# Altium project oscilloscope_ext.PrjPcb
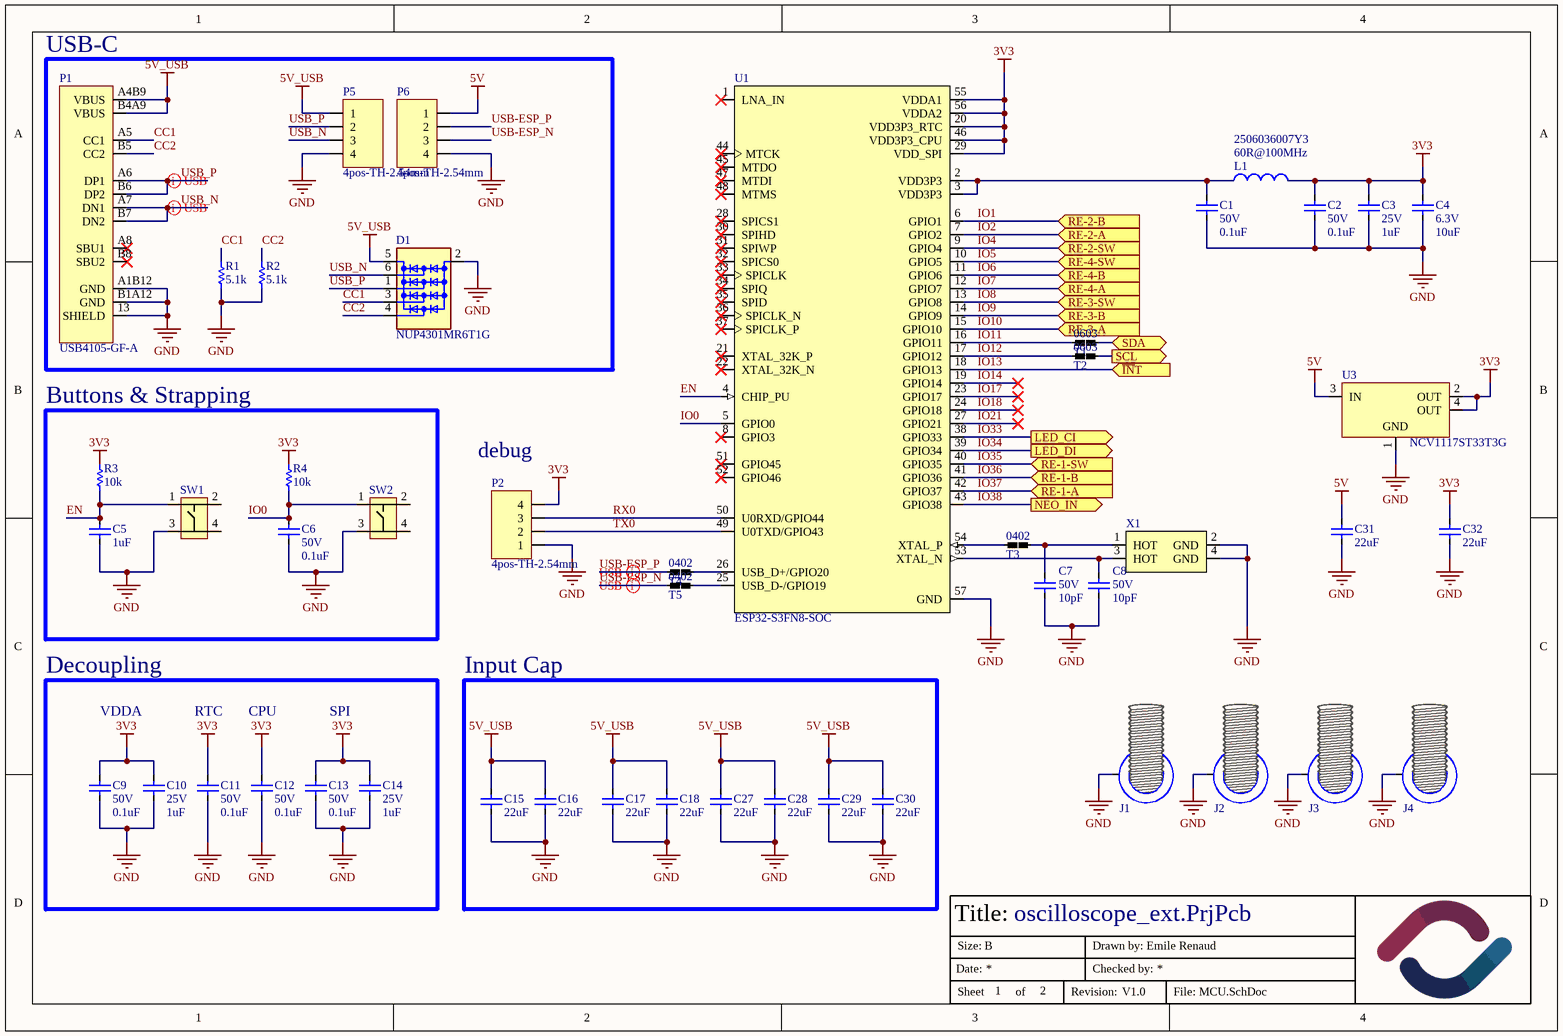
[diagram p0: MCU.SchDoc]
3 sheets, 116 parts. Net scope: flat (ports and power ports of the same name join across sheets).
Board files: oscilloscope_ext.PcbDoc, pcb_key.PcbDoc
Sheets:
  MCU.SchDoc
  RotaryEncoder.SchDoc
  CherryMX.SchDoc

## Sheet MCU.SchDoc
size A4; DrawnBy: Emile Renaud; Revision: V1.0; SheetNumber: 1; SheetTotal: 2

### Parts
C1  value 0.1uF  Volt: 50V  [CAPACITOR-0603]  (hidden comment: Capacitor-0603-0.1uF-50V-X7R)
C2  value 0.1uF  Volt: 50V  [CAPACITOR-0603]  (hidden comment: Capacitor-0603-0.1uF-50V-X7R)
C3  value 1uF  Volt: 25V  [CAPACITOR-0603]  (hidden comment: Capacitor-0603-1uF-25V-X5R)
C4  value 10uF  Volt: 6.3V  [CAPACITOR-0603]  (hidden comment: Capacitor-0603-10uF-6.3V-X5R)
C5  value 1uF  [CAPACITOR-0603]  (hidden comment: Capacitor-0603-1uF-25V-X5R)
C6  value 0.1uF  Volt: 50V  [CAPACITOR-0603]  (hidden comment: Capacitor-0603-0.1uF-50V-X7R)
C7  value 10pF  Volt: 50V  [CAPACITOR-0402]  (hidden comment: Capacitor-0402-10pF-50V-C0G)
C8  value 10pF  Volt: 50V  [CAPACITOR-0402]  (hidden comment: Capacitor-0402-10pF-50V-C0G)
C9  value 0.1uF  Volt: 50V  [CAPACITOR-0603]  (hidden comment: Capacitor-0603-0.1uF-50V-X7R)
C10  value 1uF  Volt: 25V  [CAPACITOR-0603]  (hidden comment: Capacitor-0603-1uF-25V-X5R)
C11  value 0.1uF  Volt: 50V  [CAPACITOR-0603]  (hidden comment: Capacitor-0603-0.1uF-50V-X7R)
C12  value 0.1uF  Volt: 50V  [CAPACITOR-0603]  (hidden comment: Capacitor-0603-0.1uF-50V-X7R)
C13  value 0.1uF  Volt: 50V  [CAPACITOR-0603]  (hidden comment: Capacitor-0603-0.1uF-50V-X7R)
C14  value 1uF  Volt: 25V  [CAPACITOR-0603]  (hidden comment: Capacitor-0603-1uF-25V-X5R)
C15  value 22uF  [CAPACITOR-0805]  (hidden comment: Capacitor-0805-22uF-16V-X5R)
C16  value 22uF  [CAPACITOR-0805]  (hidden comment: Capacitor-0805-22uF-16V-X5R)
C17  value 22uF  [CAPACITOR-0805]  (hidden comment: Capacitor-0805-22uF-16V-X5R)
C18  value 22uF  [CAPACITOR-0805]  (hidden comment: Capacitor-0805-22uF-16V-X5R)
C27  value 22uF  [CAPACITOR-0805]  (hidden comment: Capacitor-0805-22uF-16V-X5R)
C28  value 22uF  [CAPACITOR-0805]  (hidden comment: Capacitor-0805-22uF-16V-X5R)
C29  value 22uF  [CAPACITOR-0805]  (hidden comment: Capacitor-0805-22uF-16V-X5R)
C30  value 22uF  [CAPACITOR-0805]  (hidden comment: Capacitor-0805-22uF-16V-X5R)
C31  value 22uF  [CAPACITOR-0805]  (hidden comment: Capacitor-0805-22uF-16V-X5R)
C32  value 22uF  [CAPACITOR-0805]  (hidden comment: Capacitor-0805-22uF-16V-X5R)
D1  NUP4301MR6T1G  [SOT-23-6]
J1  hole  [HOLE-3.40MM-M3-8MMEYELET]  (value not drawn)  (no BOM)
J2  hole  [HOLE-3.40MM-M3-8MMEYELET]  (value not drawn)  (no BOM)
J3  hole  [HOLE-3.40MM-M3-8MMEYELET]  (value not drawn)  (no BOM)
J4  hole  [HOLE-3.40MM-M3-8MMEYELET]  (value not drawn)  (no BOM)
L1  2506036007Y3  value 60R@100MHz  [CAPACITOR-0603]
P1  USB4105-GF-A  [USB-C]
P2  4pos-TH-2.54mm  [HDR1X4]
P5  4pos-TH-2.54mm  [HDR1X4]
P6  4pos-TH-2.54mm  [HDR1X4]
R1  value 5.1k  [RESISTOR-0603]  (hidden comment: Resistor-0603-5.1k)
R2  value 5.1k  [RESISTOR-0603]  (hidden comment: Resistor-0603-5.1k)
R3  value 10k  [Resistor-0603]  (hidden comment: SMT resistor)
R4  value 10k  [Resistor-0603]  (hidden comment: SMT resistor)
SW1  PTS815 SJM 250 SMTR LFS  [SW4_PTS815 SJM 250 SMTR LFS_CNK]  (value not drawn)
SW2  PTS815 SJM 250 SMTR LFS  [SW4_PTS815 SJM 250 SMTR LFS_CNK]  (value not drawn)
T1  NetTie_0603  [NetTie-0603-short]  (value not drawn)
T2  NetTie_0603  [NetTie-0603-short]  (value not drawn)
T3  NetTie_0402  [NetTie-0402]  (value not drawn)
T4  NetTie_0402  [NetTie-0402]  (value not drawn)
T5  NetTie_0402  [NetTie-0402]  (value not drawn)
U1  ESP32-S3FN8-SOC  [VFQFN-56 Exposed Pad]
U3  NCV1117ST33T3G  [SOT-223-3/TO-261-3S]
X1  CX2016DB40000D0FLJCC  [4-SMD]  (value not drawn)

### Blocks framed on the sheet
USB-C: D1 P1 P5 P6 R1 R2
Buttons & Strapping: C5 C6 R3 R4 SW1 SW2
Decoupling: C9-C14
Input Cap: C15-C18 C27-C30

### Ports
LED_CI (out), LED_DI (out), NEO_IN (out), RE-1-A (in), RE-1-B (in), RE-1-SW (in), RE-2-A (in), RE-2-B (in), RE-2-SW (in), RE-3-A (in), RE-3-B (in), RE-3-SW (in), RE-4-A (in), RE-4-B (in), RE-4-SW (in), SCL (out), SDA (bidir), ~{IN}T (in)

### Nets
3V3: C2.2 C3.2 C4.2 C9.2 C10.2 C11.2 C12.2 C13.2 C14.2 C32.2 L1.2 P2.4 R3.2 R4.2 U1.20(VDD3P3_RTC) U1.29(VDD_SPI) U1.46(VDD3P3_CPU) U1.55(VDDA1) U1.56(VDDA2) U3.2(OUT) U3.4(OUT)
5V: C31.2 P6.1 U3.3(IN)
5V_USB: C15.2 C16.2 C17.2 C18.2 C27.2 C28.2 C29.2 C30.2 D1.5(VDD) P1.A4B9(VBUS) P1.B4A9(VBUS) P5.1
GND: C1.1 C2.1 C3.1 C4.1 C5.1 C6.1 C7.1 C8.1 C9.1 C10.1 C11.1 C12.1 C13.1 C14.1 C15.1 C16.1 C17.1 C18.1 C27.1 C28.1 C29.1 C30.1 C31.1 C32.1 D1.2(GND) J1.1 J2.1 J3.1 J4.1 P1.13(SHIELD) P1.A1B12(GND) P1.B1A12(GND) P2.1 P5.4 P6.4 R1.1 R2.1 SW1.3 SW2.3 U1.57(GND) U3.1(GND) X1.2(GND) X1.4(GND)
CC1: D1.3(L3) P1.A5(CC1) R1.2
CC2: D1.4(L4) P1.B5(CC2) R2.2
EN: C5.2 R3.1 SW1.1 U1.4(CHIP_PU)
IO0: C6.2 R4.1 SW2.1 U1.5(GPIO0)
IO1: U1.6(GPIO1) ; port RE-2-B
IO2: U1.7(GPIO2) ; port RE-2-A
IO4: U1.9(GPIO4) ; port RE-2-SW
IO5: U1.10(GPIO5) ; port RE-4-SW
IO6: U1.11(GPIO6) ; port RE-4-B
IO7: U1.12(GPIO7) ; port RE-4-A
IO8: U1.13(GPIO8) ; port RE-3-SW
IO9: U1.14(GPIO9) ; port RE-3-B
IO10: U1.15(GPIO10) ; port RE-3-A
IO11: T1.2 U1.16(GPIO11)
IO12: T2.2 U1.17(GPIO12)
IO13: U1.18(GPIO13) ; port ~{IN}T
IO14: U1.19(GPIO14)
IO17: U1.23(GPIO17)
IO18: U1.24(GPIO18)
IO21: U1.27(GPIO21)
IO33: U1.38(GPIO33) ; port LED_CI
IO34: U1.39(GPIO34) ; port LED_DI
IO35: U1.40(GPIO35) ; port RE-1-SW
IO36: U1.41(GPIO36) ; port RE-1-B
IO37: U1.42(GPIO37) ; port RE-1-A
IO38: U1.43(GPIO38) ; port NEO_IN
RX0: P2.3 U1.50(U0RXD/GPIO44)
TX0: P2.2 U1.49(U0TXD/GPIO43)
USB-ESP_N: P6.3 T5.2
USB-ESP_P: P6.2 T4.2
USB_N: D1.6(L1) P1.A7(DN1) P1.B7(DN2) P5.3
USB_P: D1.1(L2) P1.A6(DP1) P1.B6(DP2) P5.2
NetC1_2: C1.2 L1.1 U1.2(VDD3P3) U1.3(VDD3P3)
NetC7_2: C7.2 T3.1 X1.1(HOT)
NetC8_2: C8.2 U1.53(XTAL_N) X1.3(HOT)
NetP8_2: T1.1 ; port SDA
NetP8_3: T2.1 ; port SCL
NetT3_2: T3.2 U1.54(XTAL_P)
NetT4_1: T4.1 U1.26(USB_D+/GPIO20)
NetT5_1: T5.1 U1.25(USB_D-/GPIO19)

Not connected (* = marked no-connect by the designer): P1 A8(SBU1)* B8(SBU2)*; SW1 2 4; SW2 2 4; U1 1(LNA_IN)* 8(GPIO3)* 21(XTAL_32K_P)* 22(XTAL_32K_N)* 28(SPICS1)* 30(SPIHD)* 31(SPIWP)* 32(SPICS0)* 33(SPICLK)* 34(SPIQ)* 35(SPID)* 36(SPICLK_N)* 37(SPICLK_P)* 44(MTCK)* 45(MTDO)* 47(MTDI)* 48(MTMS)* 51(GPIO45)* 52(GPIO46)*

### Layout directives
differential pair; differential pair class USB: USB-ESP_N, USB-ESP_P, USB_N, USB_P

### Notes on the sheet
- (near P2) debug
- VDDA
- RTC
- CPU
- SPI
- Title:
- Date:
- Size:
- B
- Drawn by:
- Checked by:
- Sheet
- of
- Revision:
- File:
- (in symbol NetTie_0402) 0402
- (in symbol NetTie_0603) 0603

### Library data of the parts
C1 C2 C6 C9 C11-C13 = Capacitor-0603-0.1uF-50V-X7R: Precision: X7R-10%; Package / Case: Metric 1608, EIA 0603; Mounted: Yes; Supplier 1: Digi-Key; Supplier Part Number 1: 1276-1935-2-ND; Supplier 2: Digi-Key; Supplier Part Number 2: 1276-1934-2-ND
C3 C10 C14 = Capacitor-0603-1uF-25V-X5R: Precision: X5R-10%; Package / Case: Metric 1608, EIA 0603; Mounted: Yes; Supplier 1: Digi-Key; Supplier Part Number 1: 1276-1859-2-ND; Supplier 2: Digi-Key; Supplier Part Number 2: 1276-1942-2-ND
C4 = Capacitor-0603-10uF-6.3V-X5R: Capacitor-0603-10uF-6.3V-X5R, Low ESR, Low ESL; Precision: X5R-20%; Supplier 1: Arrow Electronics; Supplier Part Number 1: NMC0603X5R106M6.3TRP4KF; Mounted: Yes; Package / Case: Metric 1608 , EIA 0603
C5 = Capacitor-0603-1uF-25V-X5R: Precision: X5R-10%; Volt: 25V; Package / Case: Metric 1608, EIA 0603; Mounted: Yes; Supplier 1: Digi-Key; Supplier Part Number 1: 1276-1859-2-ND; Supplier 2: Digi-Key; Supplier 3: Digi-Key; Supplier 4: Digi-Key; Supplier Part Number 2: 1276-1942-2-ND
C7 C8 = Capacitor-0402-10pF-50V-C0G: Precision: C0G - 10%; Package / Case: 0402 (1005 Metric); Mounted: Yes; Supplier 1: Digi-Key; Supplier Part Number 1: 399-C0402C100K5GAC7867CT-ND; Supplier 2: Digi-Key; HelpURL: https://connect.kemet.com:7667/gateway/IntelliData-ComponentDocumentation/1.0/download/datasheet/C0402C100K5GACTU
C15-C18 C27-C32 = Capacitor-0805-22uF-16V-X5R: Precision: X5R-10%; Volt: 16V; Package / Case: Metric 2012 , EIA 0805; Mounted: Yes; Supplier 1: Digi-Key; Supplier Part Number 1: 1276-6780-1-ND; Supplier 2: Digi-Key; Supplier 3: Digi-Key; Supplier 4: Digi-Key
D1 = NUP4301MR6T1G: 4CH Clamp Ipp Tvs Diode Surface Mount SOT23-6 (SC74); Volt: 70; Supplier 1: Digi-Key; Supplier Part Number 1: NUP4301MR6T1GOSTR-ND; Mounted: Yes; Package / Case: SOT23-6
J1-J4 = Hole 3.40mm M3-Eyelet: Hole for M3 Bolt with 8mm pad; Mounted: N/A
L1 = 2506036007Y3: 60 Ohms @ 100 MHz 1 Signal Line Ferrite Bead 0603 (1608 Metric) 3A 40mOhm; Supplier 1: Digi-Key; Mounted: Yes; Supplier Part Number 1: 1934-1396-1-ND; Package / Case: SMD; Current: 3A
P1 = USB4105-GF-A: CONN RCP USB2.0 TYP C 24P SMD RA / 5A; Supplier 1: Digikey; Supplier Part Number 1: 2073-USB4105-GF-ACT-ND; Mounted: Yes; Package / Case: SMD; Volt: N/A
P2 P5 P6 = 4pos-TH-2.54mm: 4pos TH 2.54mm Header; Supplier 1: Digi-Key; Supplier Part Number 1: N/A; Mounted: Yes; Package / Case: TH; Volt: N/A
R1 R2 = Resistor-0603-DNI: 0603 footprint DO NOT INSTALL; Mounted: Yes; Package/Case: Metric 1608 , EIA 0603
R3 R4 = Resistor0603-10k: Precision: 1%; Watt: 0.1W; Mounted: Yes; Package / Case: Metric 1608, EIA 0603; Supplier 2: Digi-Key; Supplier 4: Digi-Key; Supplier Part Number 2: RMCF0603FT10K0TR-ND; Supplier 1: Digi-Key; Supplier 3: Digi-Key; Supplier Part Number 1: 311-10.0KHRTR-ND
SW1 SW2 = PTS815 SJM 250 SMTR LFS: TACT 4.2 X 3.2, 2.5 MM H, 180GF,; Volt: 12V; Current: 0.05A; Supplier 1: Digi-Key; Supplier Part Number 1: CKN12215-1-ND; Mounted: Yes
U1 = ESP32-S3FN8-SOC: IC RF TxRx + MCU Bluetooth, WiFi 802.11b/g/n, Bluetooth v5.0 2.412GHz ~ 2.484GHz 56-VFQFN Exposed Pad; MF: Espressif Systems; Availability: In Stock; MP: ESP32-S3FN8; Package: 56-VFQFN Exposed Pad; DigiKey Link: https://www.digikey.ca/en/products/detail/espressif-systems/ESP32-S3FN8/15822446; HelpURL: https://www.espressif.com/sites/default/files/documentation/esp32-s3_datasheet_en.pdf; Supplier 1: Digikey; Supplier Part Number 1: 1965-ESP32-S3FN8-ND
U3 = NCV1117ST33T3G: IC REG LINEAR 3.3V 1A SOT223; Supplier 1: Digi-Key; Supplier Part Number 1: NCV1117ST33T3GOSCT-ND; Package / Case: SOT223; Mounted: Yes
X1 = CX2016DB40000D0FLJCC: 40 MHz ±10ppm Crystal 8pF 50 Ohms 4-SMD, No Lead; Supplier 1: Digikey; Supplier Part Number 1: 478-CX2016DB40000D0FLJCCCT-ND; Parameter 1: *

## Sheet RotaryEncoder.SchDoc
size A4; DrawnBy: Emile Renaud; Revision: V1.0; SheetNumber: 2; SheetTotal: 2
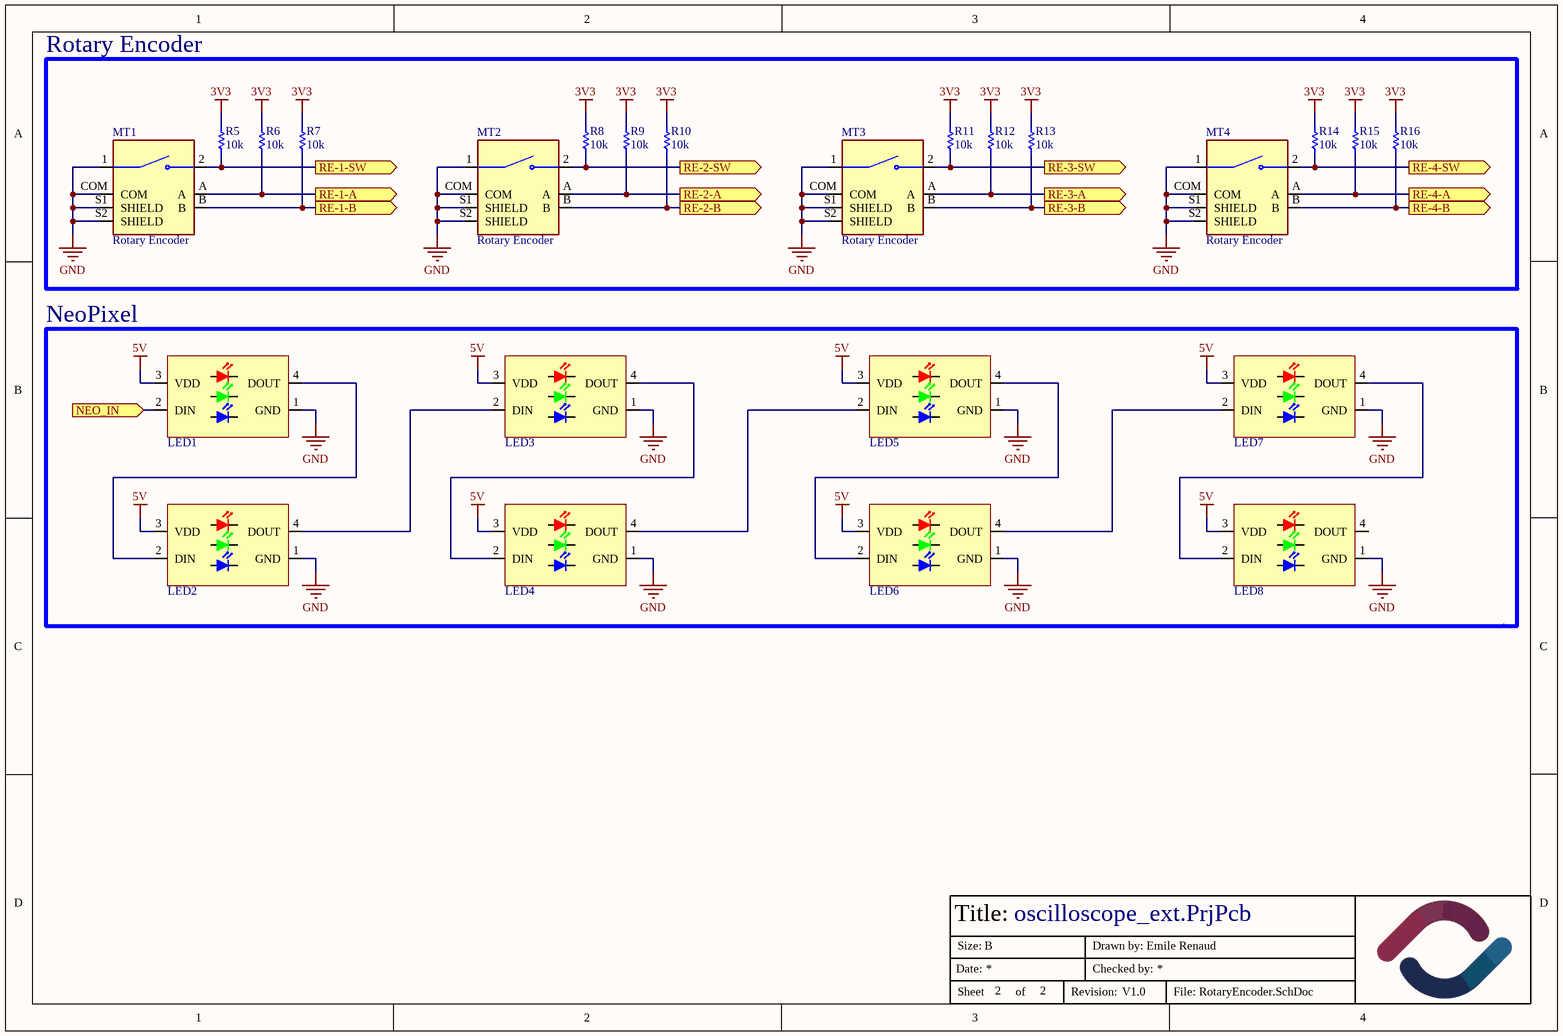
[diagram p1: RotaryEncoder.SchDoc]

### Parts
LED1  1528-1104-ND  [LED_NEO]  (value not drawn)
LED2  1528-1104-ND  [LED_NEO]  (value not drawn)
LED3  1528-1104-ND  [LED_NEO]  (value not drawn)
LED4  1528-1104-ND  [LED_NEO]  (value not drawn)
LED5  1528-1104-ND  [LED_NEO]  (value not drawn)
LED6  1528-1104-ND  [LED_NEO]  (value not drawn)
LED7  1528-1104-ND  [LED_NEO]  (value not drawn)
LED8  1528-1104-ND  [LED_NEO]  (value not drawn)
MT1  Rotary Encoder  [XDCR_PEC11R-4215F-S0024]
MT2  Rotary Encoder  [XDCR_PEC11R-4215F-S0024]
MT3  Rotary Encoder  [XDCR_PEC11R-4215F-S0024]
MT4  Rotary Encoder  [XDCR_PEC11R-4215F-S0024]
R5  value 10k  [Resistor-0603]  (hidden comment: SMT resistor)
R6  value 10k  [Resistor-0603]  (hidden comment: SMT resistor)
R7  value 10k  [Resistor-0603]  (hidden comment: SMT resistor)
R8  value 10k  [Resistor-0603]  (hidden comment: SMT resistor)
R9  value 10k  [Resistor-0603]  (hidden comment: SMT resistor)
R10  value 10k  [Resistor-0603]  (hidden comment: SMT resistor)
R11  value 10k  [Resistor-0603]  (hidden comment: SMT resistor)
R12  value 10k  [Resistor-0603]  (hidden comment: SMT resistor)
R13  value 10k  [Resistor-0603]  (hidden comment: SMT resistor)
R14  value 10k  [Resistor-0603]  (hidden comment: SMT resistor)
R15  value 10k  [Resistor-0603]  (hidden comment: SMT resistor)
R16  value 10k  [Resistor-0603]  (hidden comment: SMT resistor)

### Blocks framed on the sheet
Rotary Encoder: MT1-MT4 R5-R16
NeoPixel: LED1-LED8

### Ports
NEO_IN (in), RE-1-A (out), RE-1-B (out), RE-1-SW (out), RE-2-A (out), RE-2-B (out), RE-2-SW (out), RE-3-A (out), RE-3-B (out), RE-3-SW (out), RE-4-A (out), RE-4-B (out), RE-4-SW (out)

### Nets
3V3: R5.2 R6.2 R7.2 R8.2 R9.2 R10.2 R11.2 R12.2 R13.2 R14.2 R15.2 R16.2
5V: LED1.3(VDD) LED2.3(VDD) LED3.3(VDD) LED4.3(VDD) LED5.3(VDD) LED6.3(VDD) LED7.3(VDD) LED8.3(VDD)
GND: LED1.1(GND) LED2.1(GND) LED3.1(GND) LED4.1(GND) LED5.1(GND) LED6.1(GND) LED7.1(GND) LED8.1(GND) MT1.1 MT1.COM MT1.S1(SHIELD) MT1.S2(SHIELD) MT2.1 MT2.COM MT2.S1(SHIELD) MT2.S2(SHIELD) MT3.1 MT3.COM MT3.S1(SHIELD) MT3.S2(SHIELD) MT4.1 MT4.COM MT4.S1(SHIELD) MT4.S2(SHIELD)
IO1: MT2.B R10.1 ; port RE-2-B
IO2: MT2.A R9.1 ; port RE-2-A
IO4: MT2.2 R8.1 ; port RE-2-SW
IO5: MT4.2 R14.1 ; port RE-4-SW
IO6: MT4.B R16.1 ; port RE-4-B
IO7: MT4.A R15.1 ; port RE-4-A
IO8: MT3.2 R11.1 ; port RE-3-SW
IO9: MT3.B R13.1 ; port RE-3-B
IO10: MT3.A R12.1 ; port RE-3-A
IO35: MT1.2 R5.1 ; port RE-1-SW
IO36: MT1.B R7.1 ; port RE-1-B
IO37: MT1.A R6.1 ; port RE-1-A
IO38: LED1.2(DIN) ; port NEO_IN
NetLED1_4: LED1.4(DOUT) LED2.2(DIN)
NetLED2_4: LED2.4(DOUT) LED3.2(DIN)
NetLED3_4: LED3.4(DOUT) LED4.2(DIN)
NetLED4_4: LED4.4(DOUT) LED5.2(DIN)
NetLED5_4: LED5.4(DOUT) LED6.2(DIN)
NetLED6_4: LED6.4(DOUT) LED7.2(DIN)
NetLED7_4: LED7.4(DOUT) LED8.2(DIN)

Not connected (* = marked no-connect by the designer): LED8 4(DOUT)

### Notes on the sheet
- Title:
- Date:
- Size:
- B
- Drawn by:
- Checked by:
- Sheet
- of
- Revision:
- File:

### Library data of the parts
LED1-LED8 = Led-NeoPixel: LED RGB COMMON CATHODE (0.95(L)X; Package / Case: 4-SMD; Mounted: Yes; Supplier 1: Digi-Key; Supplier Part Number 1: 1528-1104-ND
MT1-MT4 = PEC11R-4215F-S0024: Incremental Encoder, 12 Mm, Contact Rating 10 Ma - 5 Vdc; Price: None; Availability: Unavailable; MP: PEC11R-4215F-S0024; Value: *; Package: None
R5-R16 = Resistor0603-10k: Precision: 1%; Watt: 0.1W; Mounted: Yes; Package / Case: Metric 1608, EIA 0603; Supplier 2: Digi-Key; Supplier 4: Digi-Key; Supplier Part Number 2: RMCF0603FT10K0TR-ND; Supplier 1: Digi-Key; Supplier 3: Digi-Key; Supplier Part Number 1: 311-10.0KHRTR-ND

## Sheet CherryMX.SchDoc
size A4; DrawnBy: Emile Renaud; Revision: V1.0; SheetNumber: 2; SheetTotal: 2
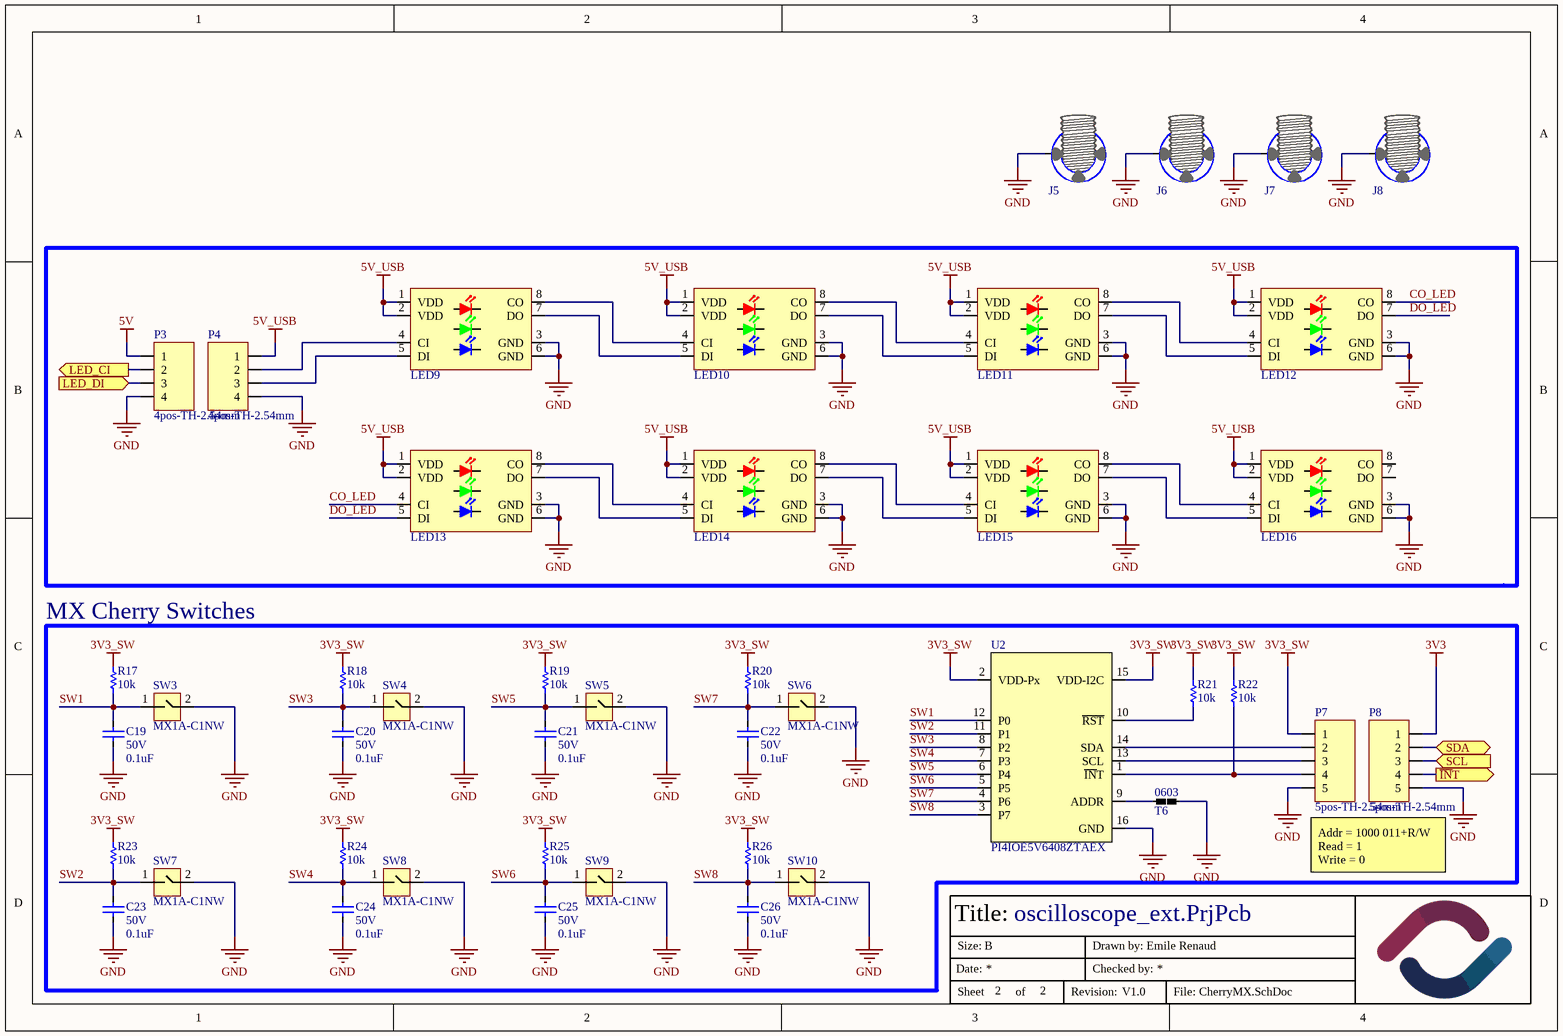
[diagram p2: CherryMX.SchDoc]

### Parts
C19  value 0.1uF  Volt: 50V  [CAPACITOR-0603]  (hidden comment: Capacitor-0603-0.1uF-50V-X7R)
C20  value 0.1uF  Volt: 50V  [CAPACITOR-0603]  (hidden comment: Capacitor-0603-0.1uF-50V-X7R)
C21  value 0.1uF  Volt: 50V  [CAPACITOR-0603]  (hidden comment: Capacitor-0603-0.1uF-50V-X7R)
C22  value 0.1uF  Volt: 50V  [CAPACITOR-0603]  (hidden comment: Capacitor-0603-0.1uF-50V-X7R)
C23  value 0.1uF  Volt: 50V  [CAPACITOR-0603]  (hidden comment: Capacitor-0603-0.1uF-50V-X7R)
C24  value 0.1uF  Volt: 50V  [CAPACITOR-0603]  (hidden comment: Capacitor-0603-0.1uF-50V-X7R)
C25  value 0.1uF  Volt: 50V  [CAPACITOR-0603]  (hidden comment: Capacitor-0603-0.1uF-50V-X7R)
C26  value 0.1uF  Volt: 50V  [CAPACITOR-0603]  (hidden comment: Capacitor-0603-0.1uF-50V-X7R)
J5  hole  [HOLE-M2-Bolt]  (value not drawn)  (no BOM)
J6  hole  [HOLE-M2-Bolt]  (value not drawn)  (no BOM)
J7  hole  [HOLE-M2-Bolt]  (value not drawn)  (no BOM)
J8  hole  [HOLE-M2-Bolt]  (value not drawn)  (no BOM)
LED9  DotStar Micro  [LED_DOTSTAR]  (value not drawn)
LED10  DotStar Micro  [LED_DOTSTAR]  (value not drawn)
LED11  DotStar Micro  [LED_DOTSTAR]  (value not drawn)
LED12  DotStar Micro  [LED_DOTSTAR]  (value not drawn)
LED13  DotStar Micro  [LED_DOTSTAR]  (value not drawn)
LED14  DotStar Micro  [LED_DOTSTAR]  (value not drawn)
LED15  DotStar Micro  [LED_DOTSTAR]  (value not drawn)
LED16  DotStar Micro  [LED_DOTSTAR]  (value not drawn)
P3  4pos-TH-2.54mm  [HDR1X4]
P4  4pos-TH-2.54mm  [HDR1X4]
P7  5pos-TH-2.54mm  [HDR1X5]
P8  5pos-TH-2.54mm  [HDR1X5]
R17  value 10k  [Resistor-0603]  (hidden comment: SMT resistor)
R18  value 10k  [Resistor-0603]  (hidden comment: SMT resistor)
R19  value 10k  [Resistor-0603]  (hidden comment: SMT resistor)
R20  value 10k  [Resistor-0603]  (hidden comment: SMT resistor)
R21  value 10k  [Resistor-0603]  (hidden comment: SMT resistor)
R22  value 10k  [Resistor-0603]  (hidden comment: SMT resistor)
R23  value 10k  [Resistor-0603]  (hidden comment: SMT resistor)
R24  value 10k  [Resistor-0603]  (hidden comment: SMT resistor)
R25  value 10k  [Resistor-0603]  (hidden comment: SMT resistor)
R26  value 10k  [Resistor-0603]  (hidden comment: SMT resistor)
SW3  MX1A-C1NW  [MX2A-G1NB]
SW4  MX1A-C1NW  [MX2A-G1NB]
SW5  MX1A-C1NW  [MX2A-G1NB]
SW6  MX1A-C1NW  [MX2A-G1NB]
SW7  MX1A-C1NW  [MX2A-G1NB]
SW8  MX1A-C1NW  [MX2A-G1NB]
SW9  MX1A-C1NW  [MX2A-G1NB]
SW10  MX1A-C1NW  [MX2A-G1NB]
T6  NetTie_0603  [NetTie-0603-short]  (value not drawn)
U2  PI4IOE5V6408ZTAEX  [UQFN-16]

### Blocks framed on the sheet
MX Cherry Switches: C19-C26 P7 P8 R17-R26 SW3-SW10 T6 U2

### Ports
LED_CI (out), LED_DI (in), SCL (in), SDA (bidir), ~{IN}T (out)

### Nets
3V3: P8.1
3V3_SW: P7.1 R17.2 R18.2 R19.2 R20.2 R21.2 R22.2 R23.2 R24.2 R25.2 R26.2 U2.2(VDD-Px) U2.15(VDD-I2C)
5V: P3.1
5V_USB: LED9.1(VDD) LED9.2(VDD) LED10.1(VDD) LED10.2(VDD) LED11.1(VDD) LED11.2(VDD) LED12.1(VDD) LED12.2(VDD) LED13.1(VDD) LED13.2(VDD) LED14.1(VDD) LED14.2(VDD) LED15.1(VDD) LED15.2(VDD) LED16.1(VDD) LED16.2(VDD) P4.1
GND: C19.1 C20.1 C21.1 C22.1 C23.1 C24.1 C25.1 C26.1 J5.1 J6.1 J7.1 J8.1 LED9.3(GND) LED9.6(GND) LED10.3(GND) LED10.6(GND) LED11.3(GND) LED11.6(GND) LED12.3(GND) LED12.6(GND) LED13.3(GND) LED13.6(GND) LED14.3(GND) LED14.6(GND) LED15.3(GND) LED15.6(GND) LED16.3(GND) LED16.6(GND) P3.4 P4.4 P7.5 P8.5 SW3.2 SW4.2 SW5.2 SW6.2 SW7.2 SW8.2 SW9.2 SW10.2 T6.1 U2.16(GND)
CO_LED: LED12.8(CO) LED13.4(CI)
DO_LED: LED12.7(DO) LED13.5(DI)
IO13: P8.4 ; port ~{IN}T
IO33: P3.2 ; port LED_CI
IO34: P3.3 ; port LED_DI
SW1: C19.2 R17.1 SW3.1 U2.12(P0)
SW2: C23.2 R23.1 SW7.1 U2.11(P1)
SW3: C20.2 R18.1 SW4.1 U2.8(P2)
SW4: C24.2 R24.1 SW8.1 U2.7(P3)
SW5: C21.2 R19.1 SW5.1 U2.6(P4)
SW6: C25.2 R25.1 SW9.1 U2.5(P5)
SW7: C22.2 R20.1 SW6.1 U2.4(P6)
SW8: C26.2 R26.1 SW10.1 U2.3(P7)
NetLED9_4: LED9.4(CI) P4.2
NetLED9_5: LED9.5(DI) P4.3
NetLED9_7: LED9.7(DO) LED10.5(DI)
NetLED9_8: LED9.8(CO) LED10.4(CI)
NetLED10_7: LED10.7(DO) LED11.5(DI)
NetLED10_8: LED10.8(CO) LED11.4(CI)
NetLED11_7: LED11.7(DO) LED12.5(DI)
NetLED11_8: LED11.8(CO) LED12.4(CI)
NetLED13_7: LED13.7(DO) LED14.5(DI)
NetLED13_8: LED13.8(CO) LED14.4(CI)
NetLED14_7: LED14.7(DO) LED15.5(DI)
NetLED14_8: LED14.8(CO) LED15.4(CI)
NetLED15_7: LED15.7(DO) LED16.5(DI)
NetLED15_8: LED15.8(CO) LED16.4(CI)
NetP7_2: P7.2 U2.14(SDA)
NetP7_3: P7.3 U2.13(SCL)
NetP7_4: P7.4 R22.1 U2.1(~{IN}T)
NetP8_2: P8.2 ; port SDA
NetP8_3: P8.3 ; port SCL
NetR21_1: R21.1 U2.10(~{RST})
NetT6_2: T6.2 U2.9(ADDR)

Not connected (* = marked no-connect by the designer): LED16 7(DO) 8(CO)

### Notes on the sheet
- Addr = 1000 011+R/W
  Read = 1
  Write = 0
- Title:
- Date:
- Size:
- B
- Drawn by:
- Checked by:
- Sheet
- of
- Revision:
- File:
- (in symbol NetTie_0603) 0603

### Library data of the parts
C19-C26 = Capacitor-0603-0.1uF-50V-X7R: Precision: X7R-10%; Package / Case: Metric 1608, EIA 0603; Mounted: Yes; Supplier 1: Digi-Key; Supplier Part Number 1: 1276-1935-2-ND; Supplier 2: Digi-Key; Supplier Part Number 2: 1276-1934-2-ND
J5-J8 = Hole 2.3mm M2: Hole for M2 Bolt with 4mm pad; Mounted: N/A
LED9-LED16 = DotStar Micro: Addressable Lighting - 10 LED Discrete Serial (Shift Register) Red, Green, Blue (RGB) 2.00mm L x 2.00mm W; Package / Case: 4-SMD; Mounted: Yes; Supplier 1: Digi-Key; Supplier Part Number 1: 1528-1826-ND
P3 P4 = 4pos-TH-2.54mm: 4pos TH 2.54mm Header; Supplier 1: Digi-Key; Supplier Part Number 1: N/A; Mounted: Yes; Package / Case: TH; Volt: N/A
P7 P8 = 5pos-TH-2.54mm: 5pos TH 2.54mm Header; Supplier 1: Digi-Key; Supplier Part Number 1: N/A; Mounted: Yes; Package / Case: TH; Volt: N/A
R17-R26 = Resistor0603-10k: Precision: 1%; Watt: 0.1W; Mounted: Yes; Package / Case: Metric 1608, EIA 0603; Supplier 2: Digi-Key; Supplier 4: Digi-Key; Supplier Part Number 2: RMCF0603FT10K0TR-ND; Supplier 1: Digi-Key; Supplier 3: Digi-Key; Supplier Part Number 1: 311-10.0KHRTR-ND
SW3-SW10 = MX1A-C1NW: Pushbutton Switch SPST-NO Keyswitch Through Hole; Volt: 5V; Current: 0.05A; Supplier 1: Digi-Key; Supplier Part Number 1: CH310-ND; Mounted: Yes
U2 = PI4IOE5V6408ZTAEX: I/O Expander 8 I2C 1 MHz 16-UQFN (1.8x2.6); Supplier 1: Digikey; Supplier Part Number 1: PI4IOE5V6408ZTAEXDICT-ND; Package / Case: 16-UQFN; Mounted: Yes; HelpURL: https://www.diodes.com/assets/Datasheets/PI4IOE5V6408.pdf

## Nets that join several sheets
3V3: MCU (21 pins), RotaryEncoder (12 pins), CherryMX (P8.1)
5V: MCU (C31.2 P6.1 U3.3), RotaryEncoder (8 pins), CherryMX (P3.1)
5V_USB: MCU (12 pins), CherryMX (17 pins)
GND: MCU (43 pins), RotaryEncoder (24 pins), CherryMX (42 pins)
IO1: MCU (U1.6), RotaryEncoder (MT2.B R10.1)
IO2: MCU (U1.7), RotaryEncoder (MT2.A R9.1)
IO4: MCU (U1.9), RotaryEncoder (MT2.2 R8.1)
IO5: MCU (U1.10), RotaryEncoder (MT4.2 R14.1)
IO6: MCU (U1.11), RotaryEncoder (MT4.B R16.1)
IO7: MCU (U1.12), RotaryEncoder (MT4.A R15.1)
IO8: MCU (U1.13), RotaryEncoder (MT3.2 R11.1)
IO9: MCU (U1.14), RotaryEncoder (MT3.B R13.1)
IO10: MCU (U1.15), RotaryEncoder (MT3.A R12.1)
IO13: MCU (U1.18), CherryMX (P8.4)
IO33: MCU (U1.38), CherryMX (P3.2)
IO34: MCU (U1.39), CherryMX (P3.3)
IO35: MCU (U1.40), RotaryEncoder (MT1.2 R5.1)
IO36: MCU (U1.41), RotaryEncoder (MT1.B R7.1)
IO37: MCU (U1.42), RotaryEncoder (MT1.A R6.1)
IO38: MCU (U1.43), RotaryEncoder (LED1.2)
NetP8_2: MCU (T1.1), CherryMX (P8.2)
NetP8_3: MCU (T2.1), CherryMX (P8.3)